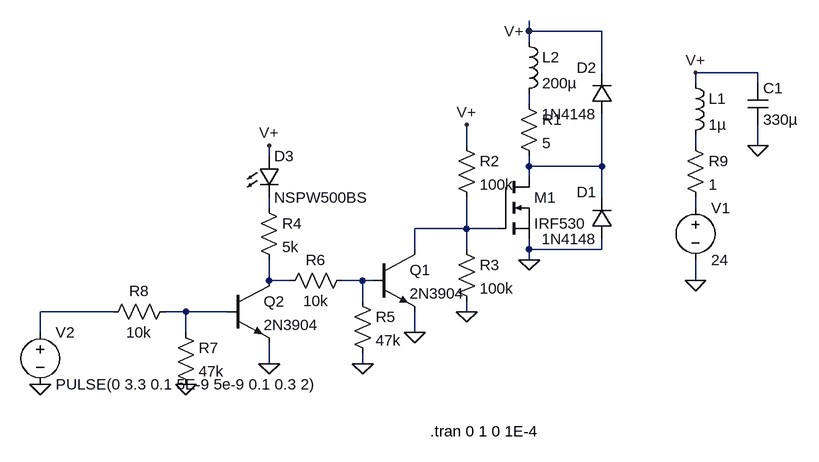
[diagram p0: schematic soldrv.asc]
soldrv.asc, the LTspice schematic file:
Version 4
SHEET 1 880 680
WIRE 288 -128 288 -144
WIRE 400 -128 288 -128
WIRE 288 -112 288 -128
WIRE 400 -64 400 -128
WIRE 640 -64 544 -64
WIRE 544 -48 544 -64
WIRE 640 -48 640 -64
WIRE 288 -16 288 -32
WIRE 192 48 192 16
WIRE 544 48 544 32
WIRE 640 48 640 16
WIRE -112 64 -112 48
WIRE 288 80 288 64
WIRE 400 80 400 0
WIRE 400 80 288 80
WIRE 288 96 288 80
WIRE 400 128 400 80
WIRE -112 144 -112 128
WIRE 544 144 544 128
WIRE 192 176 192 128
WIRE 192 176 112 176
WIRE 240 176 192 176
WIRE 112 208 112 176
WIRE 192 208 192 176
WIRE 288 208 288 192
WIRE 400 208 400 192
WIRE 400 208 288 208
WIRE 288 224 288 208
WIRE -112 256 -112 224
WIRE -80 256 -112 256
WIRE 32 256 0 256
WIRE 48 256 32 256
WIRE 544 256 544 224
WIRE 32 288 32 256
WIRE -352 304 -464 304
WIRE -240 304 -272 304
WIRE -176 304 -240 304
WIRE 192 304 192 288
WIRE -464 336 -464 304
WIRE -240 336 -240 304
WIRE 112 336 112 304
WIRE -112 384 -112 352
WIRE 32 384 32 368
FLAG 288 224 0
FLAG 192 304 0
FLAG 544 256 0
FLAG 112 336 0
FLAG 32 384 0
FLAG -112 384 0
FLAG -240 416 0
FLAG -464 416 0
FLAG 544 -64 V+
FLAG 192 16 V+
FLAG 288 -128 V+
FLAG -112 48 V+
FLAG 640 48 0
SYMBOL nmos 240 96 R0
SYMATTR InstName M1
SYMATTR Value IRF530
SYMBOL res 272 -32 R0
SYMATTR InstName R1
SYMATTR Value 5
SYMBOL res 176 32 R0
SYMATTR InstName R2
SYMATTR Value 100k
SYMBOL res 176 192 R0
SYMATTR InstName R3
SYMATTR Value 100k
SYMBOL voltage 544 128 R0
SYMATTR InstName V1
SYMATTR Value 24
SYMBOL diode 416 192 R180
WINDOW 0 24 72 Left 0
WINDOW 3 24 0 Left 0
SYMATTR InstName D1
SYMATTR Value 1N4148
SYMBOL npn 48 208 R0
SYMATTR InstName Q1
SYMATTR Value 2N3904
SYMBOL res -128 128 R0
SYMATTR InstName R4
SYMATTR Value 5k
SYMBOL res 16 272 R0
SYMATTR InstName R5
SYMATTR Value 47k
SYMBOL res 16 240 R90
WINDOW 0 0 56 VBottom 0
WINDOW 3 32 56 VTop 0
SYMATTR InstName R6
SYMATTR Value 10k
SYMBOL npn -176 256 R0
SYMATTR InstName Q2
SYMATTR Value 2N3904
SYMBOL res -256 320 R0
SYMATTR InstName R7
SYMATTR Value 47k
SYMBOL res -256 288 R90
WINDOW 0 0 56 VBottom 0
WINDOW 3 32 56 VTop 0
SYMATTR InstName R8
SYMATTR Value 10k
SYMBOL voltage -464 320 R0
WINDOW 123 0 0 Left 0
WINDOW 39 0 0 Left 0
SYMATTR InstName V2
SYMATTR Value PULSE(0 3.3 0.1 5E-9 5e-9 0.1 0.3 2)
SYMBOL res 528 32 R0
SYMATTR InstName R9
SYMATTR Value 1
SYMBOL ind 528 -64 R0
SYMATTR InstName L1
SYMATTR Value 1µ
SYMBOL ind 272 -128 R0
SYMATTR InstName L2
SYMATTR Value 200µ
SYMBOL diode 416 0 R180
WINDOW 0 24 72 Left 0
WINDOW 3 24 0 Left 0
SYMATTR InstName D2
SYMATTR Value 1N4148
SYMBOL LED -128 64 R0
SYMATTR InstName D3
SYMATTR Value NSPW500BS
SYMATTR Description Diode
SYMATTR Type diode
SYMBOL cap 624 -48 R0
SYMATTR InstName C1
SYMATTR Value 330µ
TEXT 136 488 Left 0 !.tran 0 1 0 1E-4

The netlist it stands for:
* soldrv.asc
M1 N003 N006 0 0 IRF530
R1 N001 N003 5
R2 V+ N006 100k
R3 N006 0 100k
V1 N005 0 24
D1 0 N003 1N4148
Q1 N006 N008 0 0 2N3904
R4 N004 N007 5k
R5 N008 0 47k
R6 N008 N007 10k
Q2 N007 N010 0 0 2N3904
R7 N010 0 47k
R8 N010 N009 10k
V2 N009 0 PULSE(0 3.3 0.1 5E-9 5e-9 0.1 0.3 2)
R9 N002 N005 1
L1 V+ N002 1µ
L2 V+ N001 200µ
D2 N003 V+ 1N4148
D3 V+ N004 NSPW500BS
C1 V+ 0 330µ
.model D D
.lib standard.dio
.model NPN NPN
.model PNP PNP
.lib standard.bjt
.model NMOS NMOS
.model PMOS PMOS
.lib standard.mos
.tran 0 1 0 1E-4
.backanno
.end